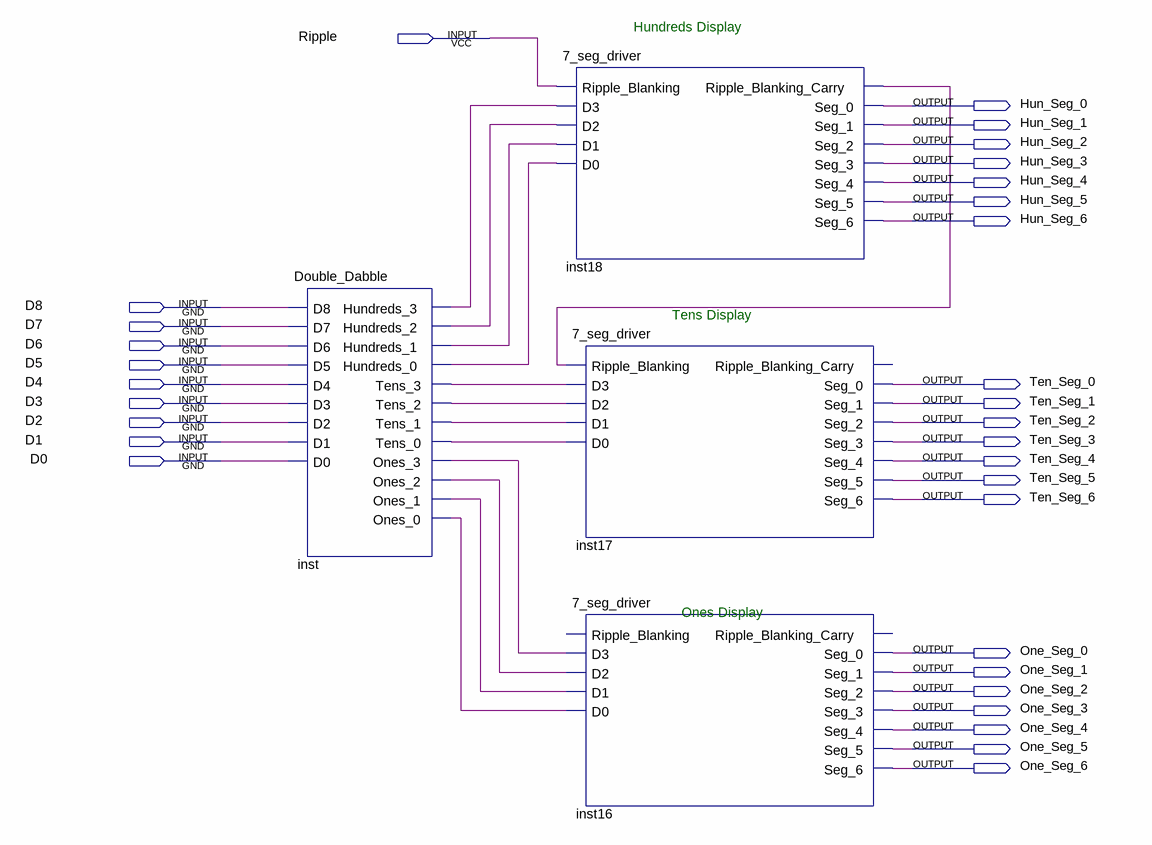
[diagram p0: schematic sheet]
// Quartus schematic 3_7segments_BCD_Display.bdf as structural Verilog: 4 symbols, 31 pins
module \3_7segments_BCD_Display  (
  input  Ripple,
  input  D8,
  input  D7,
  input  D6,
  input  D5,
  input  D4,
  input  D3,
  input  D2,
  input  D1,
  input  D0,
  output Hun_Seg_0,
  output Hun_Seg_1,
  output Hun_Seg_2,
  output Hun_Seg_3,
  output Hun_Seg_4,
  output Hun_Seg_5,
  output Hun_Seg_6,
  output Ten_Seg_0,
  output Ten_Seg_1,
  output Ten_Seg_2,
  output Ten_Seg_3,
  output Ten_Seg_4,
  output Ten_Seg_5,
  output Ten_Seg_6,
  output One_Seg_0,
  output One_Seg_1,
  output One_Seg_2,
  output One_Seg_3,
  output One_Seg_4,
  output One_Seg_5,
  output One_Seg_6
);

  wire inst18_ripple_blanking_carry, inst_hundreds_0, inst_hundreds_1, inst_hundreds_2, inst_hundreds_3,
       inst_ones_0, inst_ones_1, inst_ones_2, inst_ones_3, inst_tens_0, inst_tens_1, inst_tens_2, inst_tens_3;

  Double_Dabble inst (
    .D8(D8), .D7(D7), .D6(D6), .D5(D5), .D4(D4), .D3(D3), .D2(D2), .D1(D1), .D0(D0),
    .Hundreds_3(inst_hundreds_3), .Hundreds_2(inst_hundreds_2), .Hundreds_1(inst_hundreds_1),
    .Hundreds_0(inst_hundreds_0), .Tens_3(inst_tens_3), .Tens_2(inst_tens_2), .Tens_1(inst_tens_1),
    .Tens_0(inst_tens_0), .Ones_3(inst_ones_3), .Ones_2(inst_ones_2), .Ones_1(inst_ones_1),
    .Ones_0(inst_ones_0));
  \7_seg_driver  inst18 (
    .Ripple_Blanking(Ripple), .D3(inst_hundreds_3), .D2(inst_hundreds_2), .D1(inst_hundreds_1),
    .D0(inst_hundreds_0), .Ripple_Blanking_Carry(inst18_ripple_blanking_carry), .Seg_0(Hun_Seg_0),
    .Seg_1(Hun_Seg_1), .Seg_2(Hun_Seg_2), .Seg_3(Hun_Seg_3), .Seg_4(Hun_Seg_4), .Seg_5(Hun_Seg_5),
    .Seg_6(Hun_Seg_6));
  \7_seg_driver  inst17 (
    .Ripple_Blanking(inst18_ripple_blanking_carry), .D3(inst_tens_3), .D2(inst_tens_2), .D1(inst_tens_1),
    .D0(inst_tens_0), .Seg_0(Ten_Seg_0), .Seg_1(Ten_Seg_1), .Seg_2(Ten_Seg_2), .Seg_3(Ten_Seg_3),
    .Seg_4(Ten_Seg_4), .Seg_5(Ten_Seg_5), .Seg_6(Ten_Seg_6));  // open: Ripple_Blanking_Carry
  \7_seg_driver  inst16 (
    .D3(inst_ones_3), .D2(inst_ones_2), .D1(inst_ones_1), .D0(inst_ones_0), .Seg_0(One_Seg_0),
    .Seg_1(One_Seg_1), .Seg_2(One_Seg_2), .Seg_3(One_Seg_3), .Seg_4(One_Seg_4), .Seg_5(One_Seg_5),
    .Seg_6(One_Seg_6));  // open: Ripple_Blanking, Ripple_Blanking_Carry

  // Notes on the sheet:
  //   Hundreds Display
  //   Tens Display
  //   Ones Display
endmodule
